# EAGLE design fantimer (EAGLE 9.2.0)
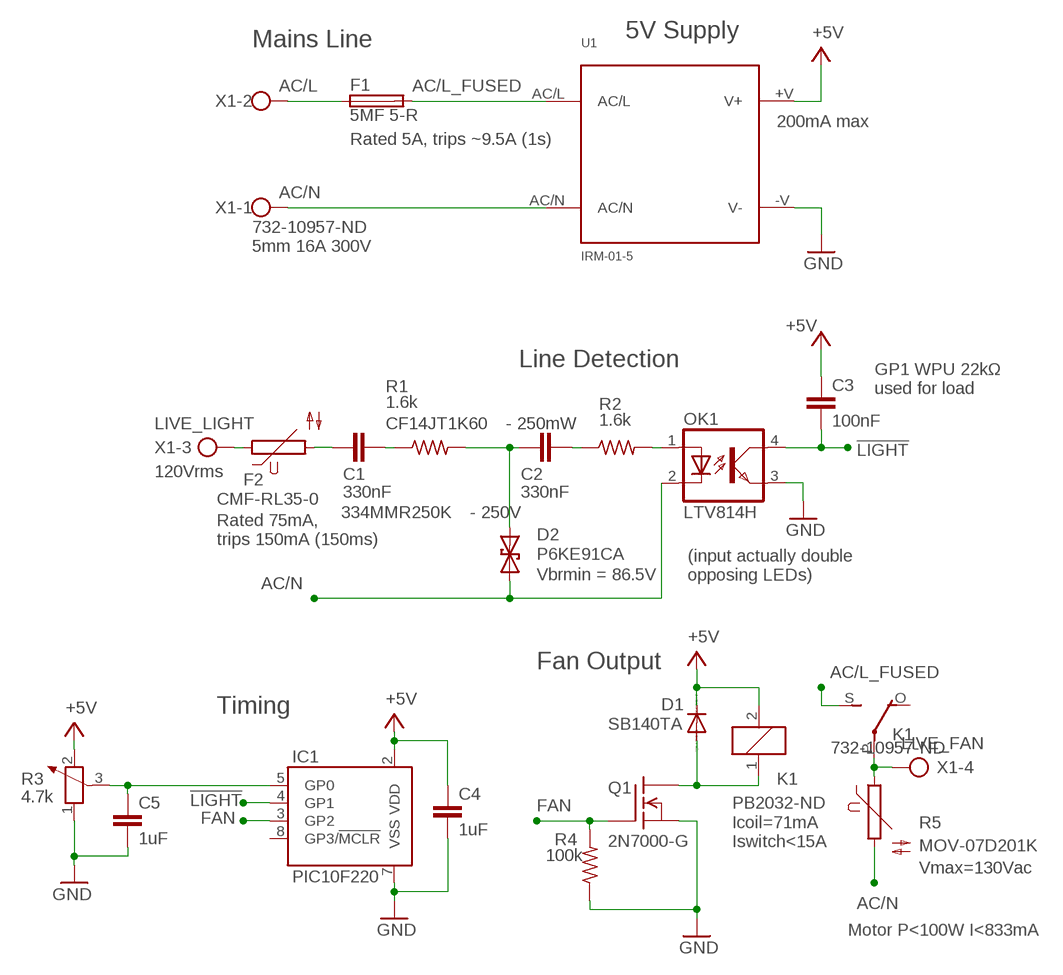
[diagram p0: schematic, sheet 1]

## Parts
C1  330nF  C-EU102-064X133  [C102-064X133]
C2  330nF  C-EU102-064X133  [C102-064X133]
C3  100nF  C-EU025-025X050  [C025-025X050]
C4  1uF  C-EU025-025X050  [C025-025X050]
C5  1uF  C-EU025-025X050  [C025-025X050]
D1  SB140TA  DIODE-DO41-7.6  [DO41-7.6]
D2  P6KE91CA  P6KEXXC  [CB417-15]
F1  5MF 5-R  FUSESHK20Q  [SHK20Q]
F2  CMF-RL35-0  S05K11  [S05K11]
IC1  PIC10F220  PIC10F220-I/P  [DIL08]
K1  PB2032-ND  G5LE  [G5LE]
OK1  LTV814H  LTV816  [DIL04]
Q1  2N7000-G  VN2222KM  [TO237]
R1  1.6k  R-US_0207/7  [0207/7]
R2  1.6k  R-US_0207/7  [0207/7]
R3  4.7k  POTENTIOMETER_PT-10  [PT-10]
R4  100k  R-US_0207/7  [0207/7]
R5  MOV-07D201K  S05K11  [S05K11]
U1  IRM-01-5  [IRM-01-X]
X1  732-10957-ND  W237-4  [W237-4]

## Nets
!LIGHT: C3.2 IC1.4(GP1) OK1.4(COL)
+5V: C3.1 C4.1 D1.C IC1.2(VDD) K1.2 R3.2 U1.+V(V+)
AC/L: F1.1A X1.2
AC/L_FUSED: F1.2A K1.S(2:S) U1.AC/L
AC/N: D2.A OK1.2(C) R5.2 U1.AC/N X1.1
ADJ: C5.1 IC1.5(GP0) R3.3
COILOUT: D1.A K1.1 Q1.1(D)
DETECT_IN: OK1.1(A) R2.2
FAN: IC1.3(GP2) Q1.2(G) R4.2
GND: C4.2 C5.2 IC1.7(VSS) OK1.3(EMIT) Q1.3(S) R3.1 R4.1 U1.-V(V-)
LIVE_FAN: K1.P(2:P) R5.1 X1.4
LIVE_LIGHT: F2.1 X1.3
LIVE_LIGHT_FUSED: C1.1 F2.2
VRC1: C1.2 R1.1
VRC2: C2.2 R2.1
VZ: C2.1 D2.C R1.2
Unconnected: IC1.8(GP3/!MCLR) K1.O(2:O)

## Notes on the sheet
- 5V Supply
- Mains Line
- 200mA max
- Rated 5A, trips ~9.5A (1s)
- 732-10957-ND
  5mm 16A 300V
- Line Detection
- GP1 WPU 22kΩ
  used for load
- CF14JT1K60‎ - 250mW
- 120Vrms
- 334MMR250K‎ - 250V
- Rated 75mA,
  trips 150mA (150ms)
- Vbrmin = 86.5V
- (input actually double
  opposing LEDs)
- Fan Output
- Timing
- Icoil=71mA
  Iswitch<15A
- Vmax=130Vac
- Motor P<100W I<833mA

## Library data of the parts
C1-C5 = rcl:C-EU: CAPACITOR, European symbol; SPICEPREFIX: C
D1 = diode:DIODE-: DIODE
D2 = diode:P6KEXXC: DIODE transient-voltage suppressor
F1 = fuse:FUSE: Fuse; OC_FARNELL: unknown; OC_NEWARK: unknown
F2 R5 = varistor:S05K11: VARISTOR
IC1 = microchip-addl:PIC10F220: PIC10F Product Family The 6-pin products of the PIC10F family offer the motor control designer an opportunity to use microcontrollers in applications that have historically been void of such devices. Whether it is cost or space constraints, PIC10F microcontrollers address these concerns by providing a pricing structure that makes them nearly disposable with form factors that can easily be implemented into the most space constrained designs. The ADC, comparator and timer peripherals found in the PIC10F device family can be used to provide a user interface for basic on/off control, speed control and other intelligent motor functions.
K1 = relay:G5LE: RELAY 1 x switch, 10 A/120 V AC, 8 A/30 V DC, Omron; OC_FARNELL: unknown; OC_NEWARK: unknown
OK1 = optocoupler:LTV816: OPTO COUPLER Source: LITEON, LTV816.pdf; OC_FARNELL: unknown; OC_NEWARK: unknown
Q1 = transistor-fet:VN2222KM: N-Channel Enhancement MOSFET (VMOS); 60V; 0,5A; 7,5Ohm
R1 R2 R4 = resistor:R-US_: RESISTOR, American symbol
R3 = rcl:POTENTIOMETER_: Potentiometer; SPICEMODEL: POT; SPICEPREFIX: X
U1 = meanwell:IRM-01-5
X1 = con-wago-500:W237-4: WAGO SCREW CLAMP; OC_FARNELL: unknown; OC_NEWARK: unknown

## Board
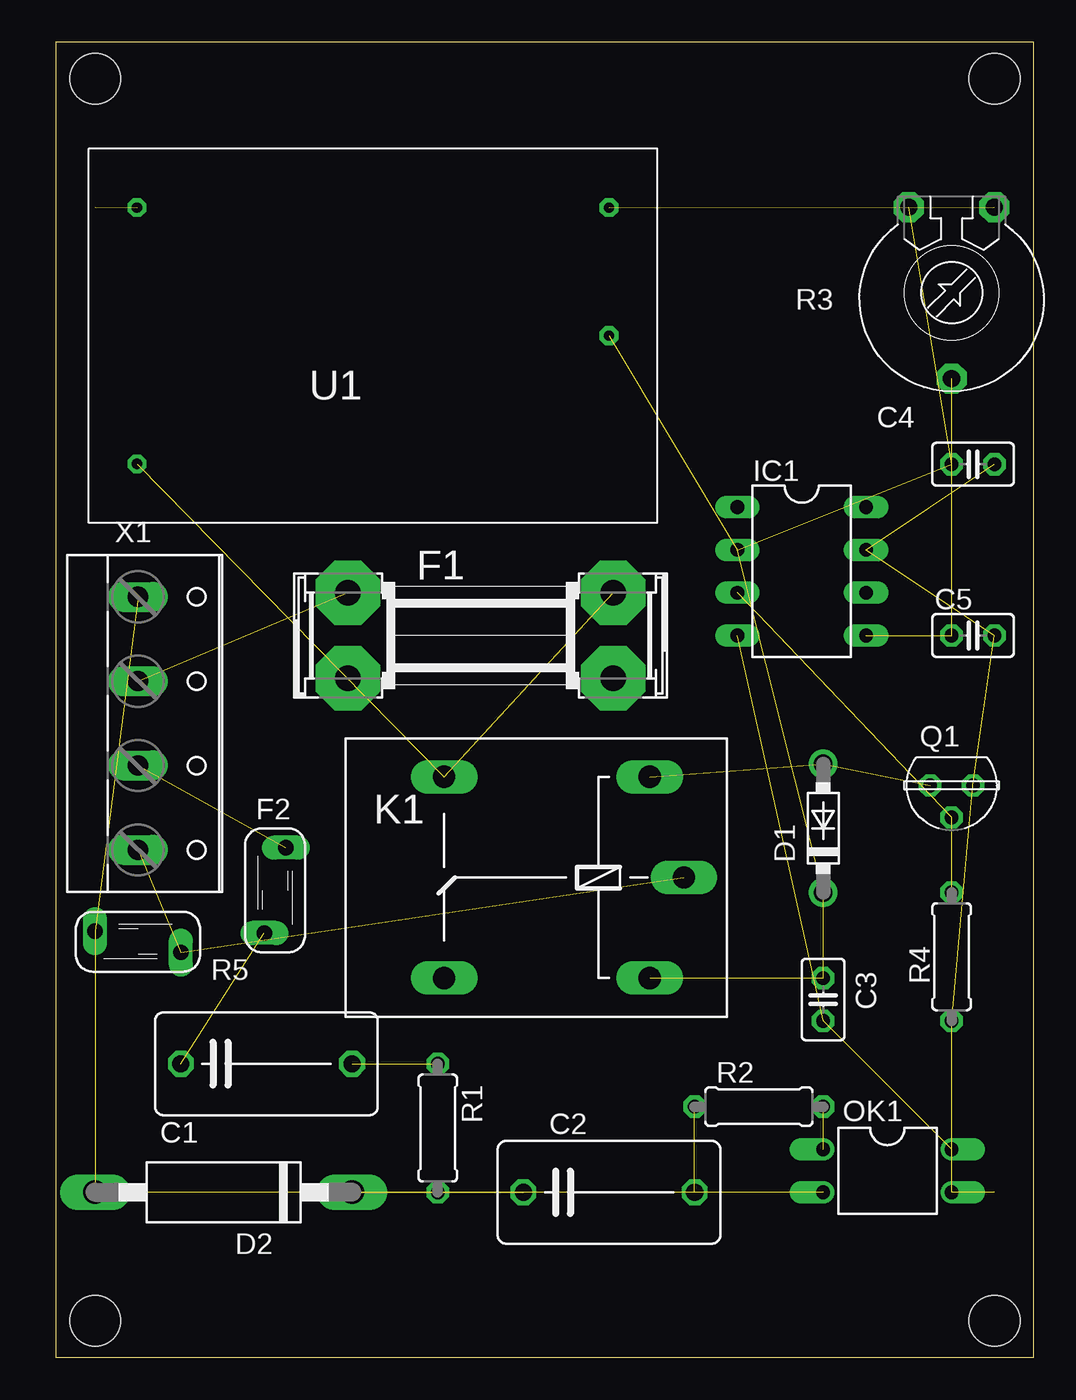
[diagram p1: board, top side]
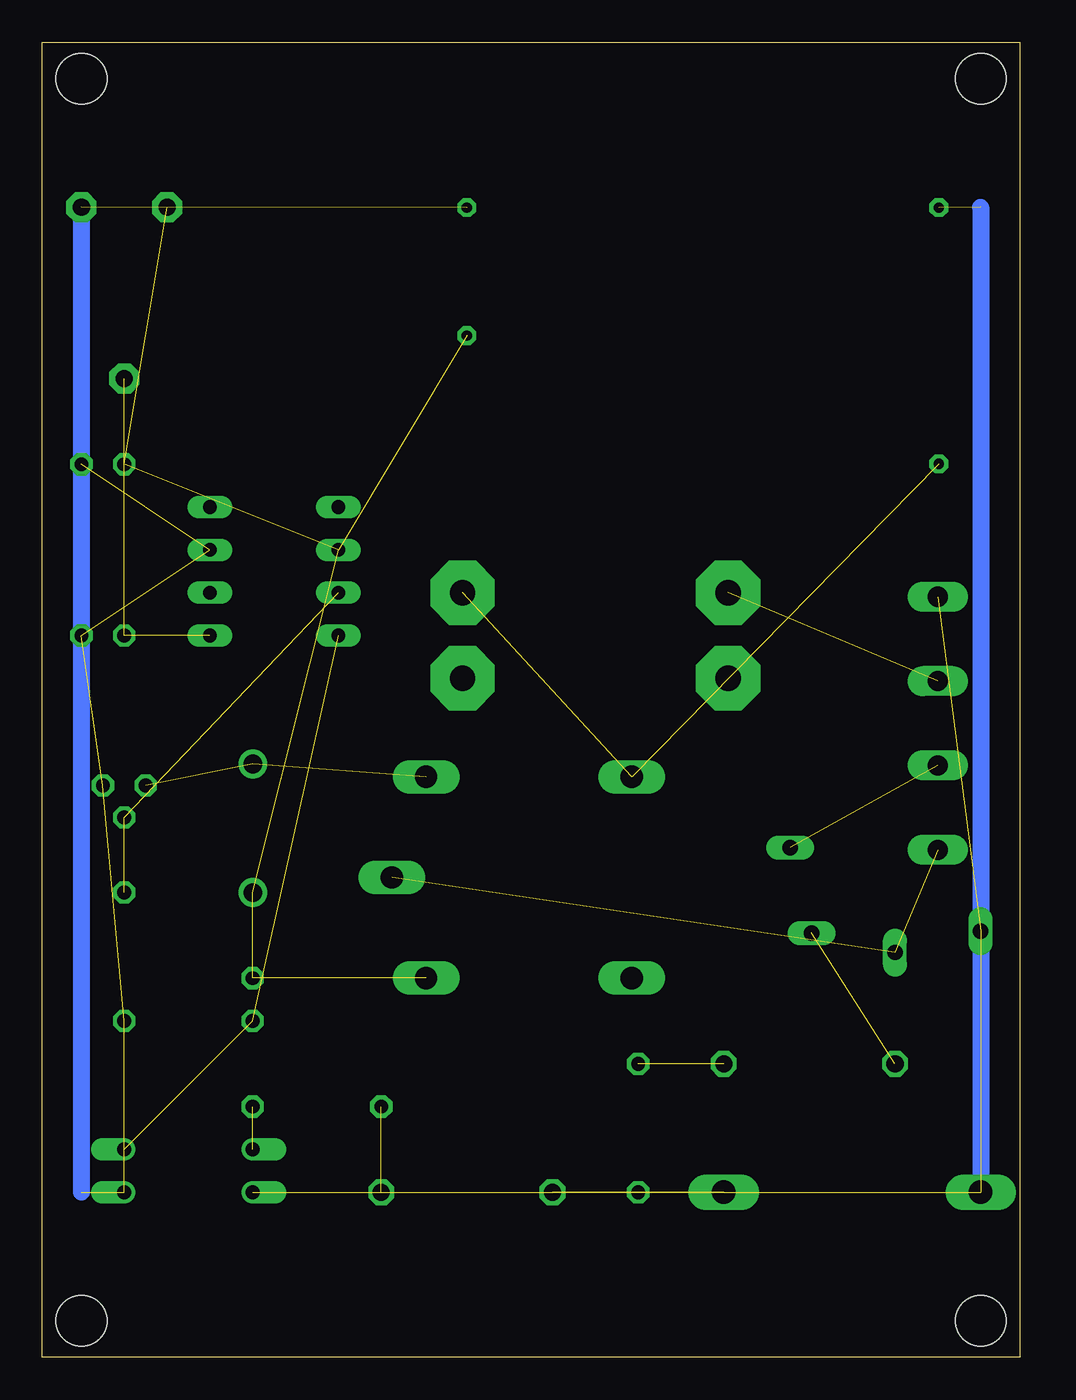
[diagram p2: board, bottom side, seen from below]

Size 58 x 78 mm. Coordinates in mm from the lower left corner, seen from the top.
Outline: 0,0 58,0 58,78 0,78 0,0
Copper layers (1*16): Top 0.035mm / dielectric 1.5mm / Bottom 0.035mm
Design rules "default": minimum track width 6mil, minimum drill 0.35mm, track to track 6mil, track to pad 6mil, pad to pad 6mil, via to via 6mil, smd to smd 6mil, copper to edge 40mil, drill to drill 6mil, minimum pad ring 10mil, minimum via ring 8mil, stop-mask expansion 4mil, vias tented up to drill 0mil, thermal gap 10mil
Holes 3 mm at 55.67,75.83 2.33,75.83 55.67,2.17 2.33,2.17
tKeepout: area -0.2,70.8 to 58.2,78.4; area -0.2,-0.4 to 58.2,7.3
vRestrict: 74 lines

### Footprints (pad centres in the part's own frame; a part is rotated, then mirrored left to right if it is on the bottom)
C102-064X133 = drill 1.016 octagon: 1 -5.08,0; 2 5.08,0
C025-025X050 = drill 0.813 octagon: 1 -1.27,0; 2 1.27,0
DO41-7.6 = drill 1.1 pad 1.7: A 3.81,0; C -3.81,0
CB417-15 = drill 1.397 long: A 7.62,0; C -7.62,0
SHK20Q = drill 1.5 pad 3.81 octagon: 1A -7.874,2.54; 1B -7.874,-2.54; 2A 7.874,2.54; 2B 7.874,-2.54
S05K11 = drill 0.914 long: 1 -0.635,-2.54; 2 0.635,2.54
DIL08 = drill 0.813 long: 1 -3.81,-3.81; 2 -1.27,-3.81; 3 1.27,-3.81; 4 3.81,-3.81; 5 3.81,3.81; 6 1.27,3.81; 7 -1.27,3.81; 8 -3.81,3.81
G5LE = drill 1.321 long: 1 -7.493,-5.969; 2 -7.493,5.969; O 4.699,5.969; P -9.525,0; S 4.699,-5.969
DIL04 = drill 0.813 offset: 1 -1.27,-3.81; 2 1.27,-3.81; 3 1.27,3.81; 4 -1.27,3.81
TO237 = drill 0.813 octagon: 1 1.27,0; 2 0,1.905; 3 -1.27,0
0207/7 = drill 0.813 octagon: 1 -3.81,0; 2 3.81,0
PT-10 = drill 1.016 pad 1.778 octagon: 1 -2.54,-5.08; 2 2.54,-5.08; 3 0,5.08
IRM-01-X = drill 0.6 octagon: +V 0,0; -V 0,-7.6; AC/L 28,7.6; AC/N 28,-7.6
W237-4 = drill 1.194 long: 1 -7.5,-1.27; 2 -2.5,-1.27; 3 2.5,-1.27; 4 7.5,-1.27

### Placement (x,y rotation side)
C1  12.49,17.41 0 top
C2  32.81,9.79 0 top
C3  45.51,21.22 270 top
C4  54.4,52.97 0 top
C5  54.4,42.81 0 top
D1  45.51,31.38 90 top
D2  9.95,9.79 180 top
F1  25.19,42.81 0 top
F2  13,27.7 180 top
IC1  44.24,46.62 270 top
K1  27.73,28.46 180 top
OK1  49.32,11.06 270 top
Q1  53.13,33.92 180 top
R1  22.65,13.6 270 top
R2  41.7,14.87 0 top
R3  53.13,63.13 180 top
R4  53.13,23.76 90 top
R5  4.87,24.65 90 top
U1  32.81,60.59 180 top
X1  6.14,37.6 270 top

### Tracks (layer width: path | path; a pad name or v marks a point on that pad's centre or on a via)
!LIGHT  (2 unrouted)
+5V  (6 unrouted)
AC/L  (1 unrouted)
AC/L_FUSED  (2 unrouted)
AC/N  (4 unrouted)
  Bottom 1.016: 2.33,68.21 D2.A
ADJ  (2 unrouted)
COILOUT  (2 unrouted)
DETECT_IN  (1 unrouted)
FAN  (2 unrouted)
GND  (7 unrouted)
  Bottom 1.016: R3.1 55.67,9.79
LIVE_FAN  (2 unrouted)
LIVE_LIGHT  (1 unrouted)
LIVE_LIGHT_FUSED  (1 unrouted)
VRC1  (1 unrouted)
VRC2  (1 unrouted)
VZ  (2 unrouted)

### Text on the board
tValues: FIT0099